# EAGLE design Robot Logic v4.5 (EAGLE 4.16)
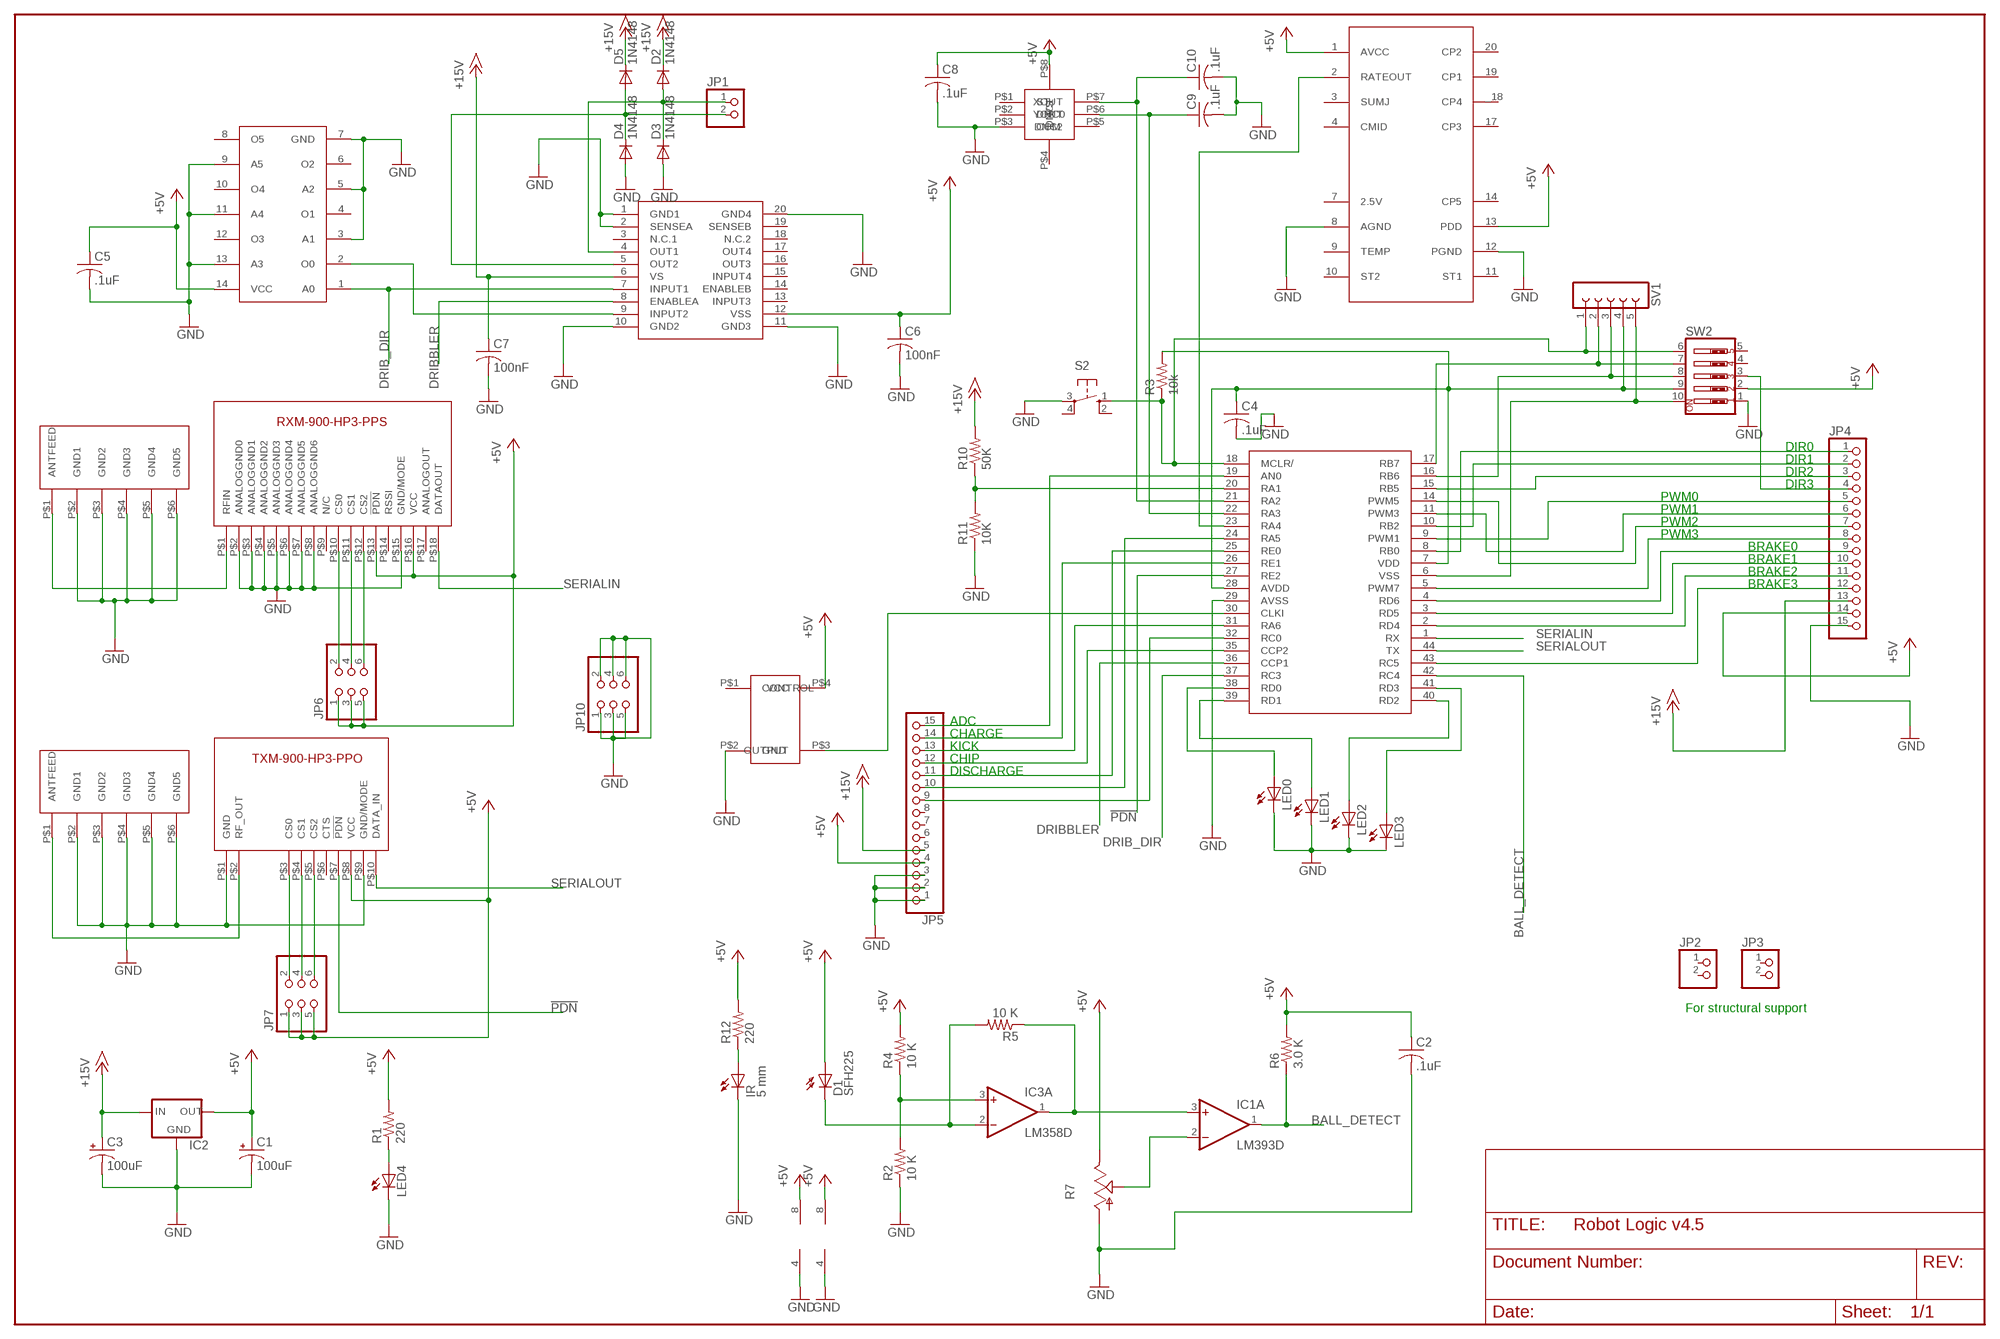
[diagram p0: schematic, sheet 1]

## Parts
C1  100uF  CPOL-USE3.5-8  [E3,5-8]
C2  .1uF  C-USC1206  [C1206]
C3  100uF  CPOL-USE3.5-8  [E3,5-8]
C4  .1uF  C-USC1206  [C1206]
C5  .1uF  C-USC1206  [C1206]
C6  100nF  C-USC1206  [C1206]
C7  100nF  C-USC1206  [C1206]
C8  .1uF  C-USC1206  [C1206]
C9  .1uF  C-USC1206  [C1206]
C10  .1uF  C-USC1206  [C1206]
D1  SFH225  [SFH225]
D2  1N4148  [DO35-10]
D3  1N4148  [DO35-10]
D4  1N4148  [DO35-10]
D5  1N4148  [DO35-10]
IC1  LM393D  [SO08]
IC2  78LXX  [D2PACK]
IC3  LM358D  [SO08]
IR  5 mm  LED3MM  [LED3MM]
JP1  PINHD-1X2  [1X02]
JP2  PINHD-1X2  [1X02]
JP3  PINHD-1X2  [1X02]
JP4  PINHD-1X15  [1X15]
JP5  PINHD-1X15  [1X15]
JP6  PINHD-2X3  [2X03]
JP7  PINHD-2X3  [2X03]
JP10  PINHD-2X3  [2X03]
LED0  LEDCHIPLED_1206  [CHIPLED_1206]
LED1  LEDCHIPLED_1206  [CHIPLED_1206]
LED2  LEDCHIPLED_1206  [CHIPLED_1206]
LED3  LEDCHIPLED_1206  [CHIPLED_1206]
LED4  LEDCHIPLED_1206  [CHIPLED_1206]
R1  220  R-US_R1206  [R1206]
R2  10 K  R-US_R1206  [R1206]
R3  10k  R-US_R1206  [R1206]
R4  10 K  R-US_R1206  [R1206]
R5  10 K  R-US_R1206  [R1206]
R6  3.0 K  R-US_R1206  [R1206]
R7  TRIM_US-  [MYPOT]
R10  50K  R-US_R1206  [R1206]
R11  10K  R-US_R1206  [R1206]
R12  220  R-US_R1206  [R1206]
S2  10-XX  [B3F-10XX]
SV1  FE05-1  [FE05-1]
SW2  SW_DIP-5  [EDG-05]
U$1  PIC18F4431  [TQFP44]
U$2  ADXL203  [LCC8]
U$3  L298  [POWERSO-20]
U$4  RX  [RX_FLAT]
U$5  SMDOSCILLATOR  [SMDOSCILLATOR]
U$6  ANT-916-SP  [ANT-916-SP]
U$7  INVERTER  [SOP14]
U$8  ADXRS150EB  [DIL20]
U$9  ANT-916-SP  [ANT-916-SP]
U$10  TXM-900-HP3-PP  [TXM-900-HP3-PP]

## Nets
!PDN: U$1.27(RE2) U$10.P$7(!PDN)
+5V [supply]: C1.+ C5.1 C6.1 C8.1 IC2.3(OUT) JP4.14 JP5.4 JP6.1 JP6.3 JP6.5 R1.2 SW2.2 U$2.P$8(VS) U$3.12(VSS) U$4.P$13(!PDN) U$4.P$16(VCC) U$5.P$4(VCC) U$7.14(VCC) U$8.1(AVCC) U$8.13(PDD)
+15V [supply]: C3.+ C7.1 D2.C D5.C IC2.1(IN) JP4.13 JP5.5 R10.2 U$3.6(VS)
BALL_DETECT: IC1.1(A:OUT) R6.1 U$1.42(RC4)
BRSHLS: JP4.1 U$1.8(RB0)
DRIB_DIR: U$1.37(RC3) U$3.7(INPUT1) U$7.1(A0)
DRIBBLER: U$1.36(CCP1) U$3.8(ENABLEA)
GND [supply]: C1.- C2.2 C3.- C4.2 C5.2 C6.2 C7.2 C8.2 C9.2 C10.2 D3.A D4.A IC1.4(P:V-) IC2.2(GND) IC3.4(P:V-) IR.K(C) JP4.15 JP5.1 JP5.2 JP5.3 JP10.1 JP10.2 JP10.3 JP10.4 JP10.5 JP10.6 LED0.C LED1.C LED2.C LED3.C LED4.C R2.1 R7.P$1(A) R11.1 S2.3(P) SW2.1 U$1.29(AVSS) U$2.P$3(COM) U$3.1(GND1) U$3.2(SENSEA) U$3.10(GND2) U$3.11(GND3) U$3.20(GND4) U$4.P$2(ANALOGGND0) U$4.P$3(ANALOGGND1) U$4.P$4(ANALOGGND2) U$4.P$5(ANALOGGND3) U$4.P$6(ANALOGGND4) U$4.P$7(ANALOGGND5) U$4.P$8(ANALOGGND6) U$4.P$15(GND/MODE) U$5.P$2(GND) U$6.P$2(GND1) U$6.P$3(GND2) U$6.P$4(GND3) U$6.P$5(GND4) U$6.P$6(GND5) U$7.3(A1) U$7.5(A2) U$7.7(GND) U$7.9(A5) U$7.11(A4) U$7.13(A3) U$8.8(AGND) U$8.12(PGND) U$9.P$2(GND1) U$9.P$3(GND2) U$9.P$4(GND3) U$9.P$5(GND4) U$9.P$6(GND5) U$10.P$1(GND) U$10.P$9(GND/MODE)
N$1: C10.1 U$1.21(RA2) U$2.P$7(XOUT)
N$2: LED2.A U$1.40(RD2)
N$3: JP5.14 U$1.26(RE1)
N$4: C9.1 U$1.22(RA3) U$2.P$6(YOUT)
N$5: U$1.23(RA4) U$8.2(RATEOUT)
N$6: R3.1 S2.1(S) SV1.1 SW2.6 U$1.18(MCLR/)
N$7: JP5.10 U$1.24(RA5)
N$8: SV1.3 SW2.8 U$1.16(RB6)
N$9: JP5.11 U$1.25(RE0)
N$11: JP5.12 U$1.35(CCP2)
N$12: JP4.3 U$1.15(RB5)
N$13: LED1.A U$1.39(RD1)
N$14: JP4.8 U$1.5(PWM7)
N$15: JP4.2 U$1.10(RB2)
N$16: JP4.5 U$1.9(PWM1)
N$17: R10.1 R11.2 U$1.20(RA1)
N$18: IR.A R12.1
N$19: LED3.A U$1.41(RD3)
N$21: JP4.4 SW2.3
N$22: LED4.A R1.1
N$23: JP6.4 U$4.P$11(CS1)
N$24: JP5.9 U$1.32(RC0)
N$25: JP5.13 U$1.31(RA6)
N$26: U$1.30(CLKI) U$5.P$3(OUTPUT)
N$29: JP5.15 U$1.19(AN0)
N$30: JP6.6 U$4.P$12(CS2)
N$31: JP6.2 U$4.P$10(CS0)
N$32: JP4.9 U$1.4(RD6)
N$33: SV1.5 SW2.10 U$1.6(VSS)
N$34: SV1.2 SW2.7 U$1.17(RB7)
N$35: JP4.7 U$1.14(PWM5)
N$36: JP4.6 U$1.11(PWM3)
N$37: JP4.10 U$1.3(RD5)
N$38: JP4.11 U$1.2(RD4)
N$39: C4.1 R3.2 SV1.4 SW2.9 U$1.7(VDD) U$1.28(AVDD)
N$40: JP4.12 U$1.43(RC5)
N$41: JP7.2 U$10.P$3(CS0)
N$42: D1.K(C) IC3.2(A:-IN) R5.2
N$43: IC3.3(A:+IN) R2.2 R4.1
N$44: IC1.3(A:+IN) IC3.1(A:OUT) R5.1
N$45: U$4.P$1(RFIN) U$6.P$1(ANTFEED)
N$46: JP7.4 U$10.P$4(CS1)
N$47: IC1.2(A:-IN) R7.P$3(S)
N$48: LED0.A U$1.38(RD0)
N$49: JP7.6 U$10.P$5(CS2)
N$50: U$3.9(INPUT2) U$7.2(O0)
N$51 [current]: D2.A D3.C JP1.1 U$3.4(OUT1)
N$52 [current]: D4.C D5.A JP1.2 U$3.5(OUT2)
N$57: U$9.P$1(ANTFEED) U$10.P$2(RF_OUT)
SERIALIN: U$1.1(RX) U$4.P$18(DATAOUT)
SERIALOUT: U$1.44(TX) U$10.P$10(DATA_IN)
VCC: C2.1 D1.A IC1.8(P:V+) IC3.8(P:V+) JP7.1 JP7.3 JP7.5 R4.2 R6.2 R7.P$2(E) R12.2 U$10.P$8(VCC) ; supply symbol labelled +5V
Unconnected: IC1.5(B:+IN) IC1.6(B:-IN) IC1.7(B:OUT) IC3.5(B:+IN) IC3.6(B:-IN) IC3.7(B:OUT) JP2.1 JP2.2 JP3.1 JP3.2 JP5.6 JP5.7 JP5.8 S2.2(S1) S2.4(P1) SW2.4 SW2.5 U$2.P$1(ST) U$2.P$2(DNC0) U$2.P$4(DNC1) U$2.P$5(DNC2) U$3.3(N.C.1) U$3.13(INPUT3) U$3.14(ENABLEB) U$3.15(INPUT4) U$3.16(OUT3) U$3.17(OUT4) U$3.18(N.C.2) U$3.19(SENSEB) U$4.P$9(N/C) U$4.P$14(RSSI) U$4.P$17(ANALOGOUT) U$5.P$1(CONTROL) U$7.4(O1) U$7.6(O2) U$7.8(O5) U$7.10(O4) U$7.12(O3) U$8.3(SUMJ) U$8.4(CMID) U$8.7(2.5V) U$8.9(TEMP) U$8.10(ST2) U$8.11(ST1) U$8.14(CP5) U$8.17(CP3) U$8.19(CP1) U$8.20(CP2) U$8._18(CP4) U$10.P$6(CTS)

## Notes on the sheet
- DIR0
- DIR1
- DIR2
- DIR3
- PWM0
- PWM1
- PWM2
- PWM3
- BRAKE0
- BRAKE1
- BRAKE2
- BRAKE3
- ADC
- CHARGE
- KICK
- CHIP
- DISCHARGE
- For structural support

## Library data of the parts
C1 C3 = rcl:CPOL-US: POLARIZED CAPACITOR, American symbol
C2 C4-C10 = rcl:C-US: CAPACITOR, American symbol
D1 = opto-trans-siemens:SFH225: PHOTO DIODE
D2-D5 = diode:1N4148: DIODE high speed (Philips)
IC1 = linear:LM393: COMPARATOR
IC2 = v-reg:78LXX: VOLTAGE REGULATOR
IC3 = linear:LM358: OP AMP
IR LED0 LED1-LED4 = led:LED: LED OSRAM: - CHIPLED LG R971, LG N971, LY N971, LG Q971, LY Q971, LO R971, LY R971 LH N974, LH R974 LS Q976, LO Q976, LY Q976 LO Q996 - Hyper CHIPLED LW Q18S LB Q993, LB Q99A, LB R99A - SideLED LS A670, LO A670, LY A670, LG A670, LP A670 LB A673, LV A673, LT A673, LW A673 LH A674 LY A675 LS A676, LA A676, LO A676, LY A676, LW A676 LS A679, LY A679, LG A679 - Hyper Micro SIDELED® LS Y876, LA Y876, LO Y876, LY Y876 LT Y87S - SmartLED LW L88C, LW L88S LB L89C, LB L89S, LG L890 LS L89K, LO L89K, LY L89K LS L896, LA L896, LO L896, LY L896 - TOPLED LS T670, LO T670, LY T670, LG T670, LP T670 LSG T670, LSP T670, LSY T670, LOP T670, LYG T670 LG T671, LOG T671, LSG T671 LB T673, LV T673, LT T673, LW T673 LH T674 LS T676, LA T676, LO T676, LY T676, LB T676, LH T676, LSB T676, LW T676 LB T67C, LV T67C, LT T67C, LS T67K, LO T67K, LY T67K, LW E67C LS E67B, LA E67B, LO E67B, LY E67B, LB E67C, LV E67C, LT E67C LW T67C LS T679, LY T679, LG T679 LS T770, LO T770, LY T770, LG T770, LP T770 LB T773, LV T773, LT T773, LW T773 LH T774 LS E675, LA E675, LY E675, LS T675 LS T776, LA T776, LO T776, LY T776, LB T776 LHGB T686 LT T68C, LB T68C - Hyper Mini TOPLED® LB M676 - Mini TOPLED Santana® LG M470 LS M47K, LO M47K, LY M47K Source: http://www.osram.convergy.de/
JP1-JP3 = pinhead:PINHD-1X2: PIN HEADER
JP4 JP5 = pinhead:PINHD-1X15: PIN HEADER
JP6 JP7 JP10 = pinhead:PINHD-2X3: PIN HEADER
R1-R6 R10-R12 = rcl:R-US_: RESISTOR, American symbol
R7 = pot:TRIM_US-: POTENTIOMETER
S2 = switch-omron:10-XX: OMRON SWITCH
SV1 = con-lsta:FE05-1: FEMALE HEADER
SW2 = special:SW_DIP-5: DIP SWITCH
U$1 = microchip:PIC18F4431
U$2 = ADXL203:ADXL203
U$3 = L298:L298
U$4 = linxtechnologies:RX
U$5 = smd-oscillator:SMDOSCILLATOR
U$6 U$9 = smd-oscillator:ANT-916-SP
U$7 = smd-ipc:INVERTER
U$8 = gyro:ADXRS150EB
U$10 = linxtechnologies:TXM-900-HP3-PP

## Net classes
1 supply: width 0.508 mm
2 current: width 0.254 mm

## Board
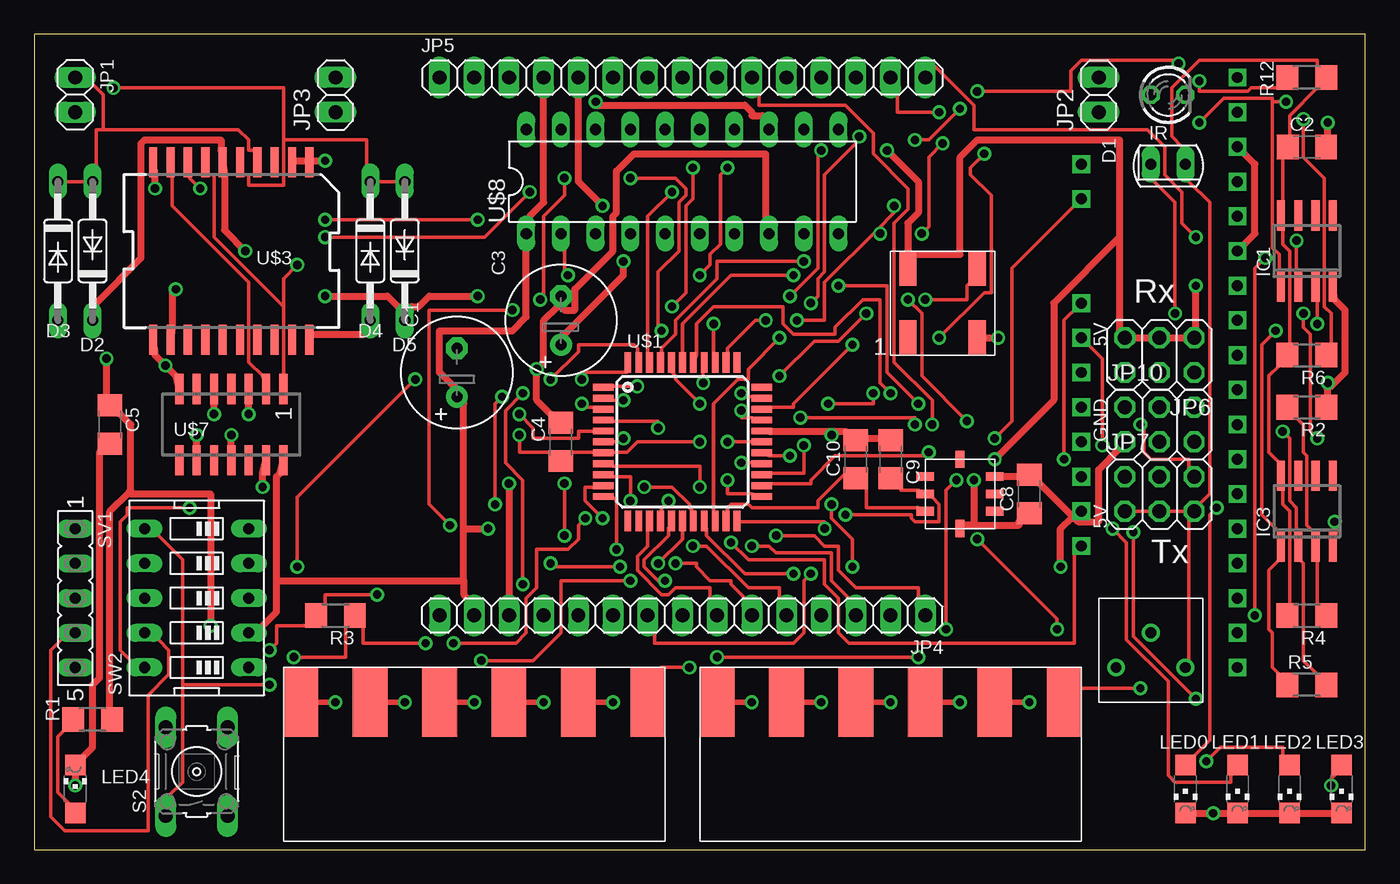
[diagram p1: board, top side]
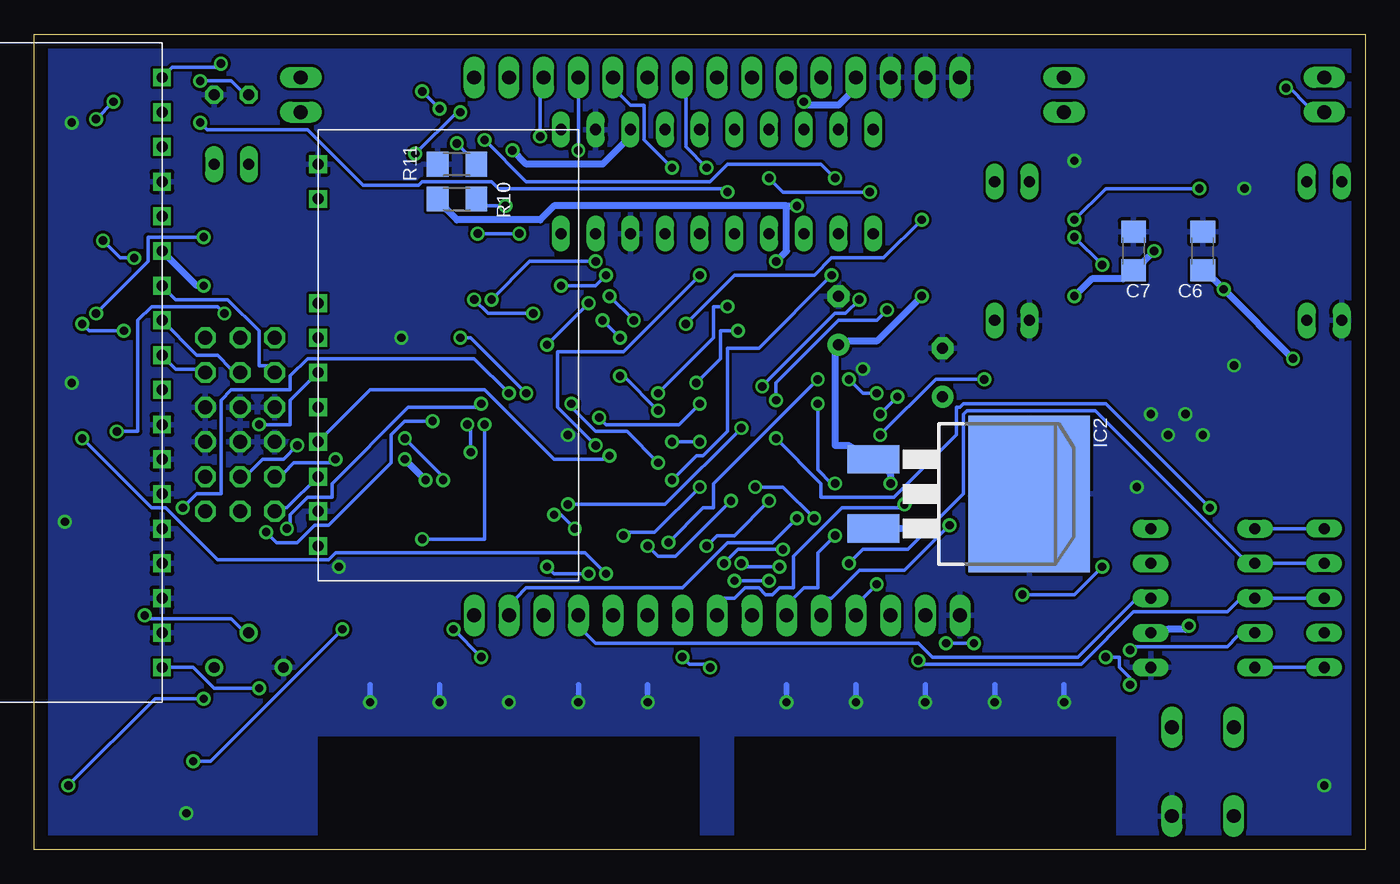
[diagram p2: board, bottom side, seen from below]

Size 97.46 x 59.68 mm. Coordinates in mm from the lower left corner, seen from the top.
Outline: 0,0 97.46,0 97.46,59.68 0,59.68 0,0
Copper layers (1*16): Top 0.035mm / dielectric 1.5mm / Bottom 0.035mm
Design rules "default": minimum track width 10mil, minimum drill 24mil, track to track 8mil, track to pad 8mil, pad to pad 8mil, via to via 8mil, smd to smd 8mil, copper to edge 40mil, drill to drill 8mil, minimum pad ring 10mil, minimum via ring 8mil, stop-mask expansion 4mil, vias tented up to drill 0mil, thermal gap 10mil
tRestrict: area 18.2,-3.2 to 46.2,8.2; area 48.7,-3.2 to 76.7,8.2
bRestrict: area 18.2,-5.7 to 46.2,8.2; area 48.7,-5.7 to 76.7,8.2

### Footprints (pad centres in the part's own frame; a part is rotated, then mirrored left to right if it is on the bottom)
E3,5-8 = drill 0.813 pad 1.6 round: + -1.778,0 | drill 0.813 pad 1.6 octagon: - 1.778,0
C1206 = smd 1.6 x 1.8: 1 -1.4,0; 2 1.4,0
SFH225 = drill 0.813 long: A 0,1.27; K 0,-1.27
DO35-10 = drill 0.813 long: A 5.08,0; C -5.08,0
SO08 = smd 0.6 x 2.2: 1 -1.905,-2.6; 2 -0.635,-2.6; 3 0.635,-2.6; 4 1.905,-2.6; 5 1.905,2.6; 6 0.635,2.6; 7 -0.635,2.6; 8 -1.905,2.6
D2PACK = smd 2.083 x 3.81: 1 -2.54,-8.89; 3 2.54,-8.89 | smd 11.43 x 8.89: 2 0,2.54
LED3MM = drill 0.813 octagon: A -1.27,0; K 1.27,0
1X02 = drill 1.016 long: 1 -1.27,0; 2 1.27,0
1X15 = drill 1.016 long: 1 -17.78,0; 2 -15.24,0; 3 -12.7,0; 4 -10.16,0; 5 -7.62,0; 6 -5.08,0; 7 -2.54,0; 8 0,0; 9 2.54,0; 10 5.08,0; 11 7.62,0; 12 10.16,0; 13 12.7,0; 14 15.24,0; 15 17.78,0
2X03 = drill 1.016 octagon: 1 -2.54,-1.27; 2 -2.54,1.27; 3 0,-1.27; 4 0,1.27; 5 2.54,-1.27; 6 2.54,1.27
CHIPLED_1206 = smd 1.5 x 1.5: A 0,-1.75; C 0,1.75
R1206 = smd 1.6 x 1.803: 1 -1.422,0; 2 1.422,0
MYPOT = drill 0.8 round: P$1 6.35,5.08; P$2 1.27,5.08; P$3 3.81,2.54
B3F-10XX = drill 1.016 long: 1 -3.251,2.261; 2 3.251,2.261; 3 -3.251,-2.261; 4 3.251,-2.261
FE05-1 = drill 0.813 long: 1 -5.08,0; 2 -2.54,0; 3 0,0; 4 2.54,0; 5 5.08,0
EDG-05 = drill 0.813 long: 1 -5.08,-3.81; 2 -2.54,-3.81; 3 0,-3.81; 4 2.54,-3.81; 5 5.08,-3.81; 6 5.08,3.81; 7 2.54,3.81; 8 0,3.81; 9 -2.54,3.81; 10 -5.08,3.81
TQFP44 = smd 1.5 x 0.5: 1 -5.8,4; 2 -5.8,3.2; 3 -5.8,2.4; 4 -5.8,1.6; 5 -5.8,0.8; 6 -5.8,0; 7 -5.8,-0.8; 8 -5.8,-1.6; 9 -5.8,-2.4; 10 -5.8,-3.2; 11 -5.8,-4; 23 5.8,-4; 24 5.8,-3.2; 25 5.8,-2.4; 26 5.8,-1.6; 27 5.8,-0.8; 28 5.8,0; 29 5.8,0.8; 30 5.8,1.6; 31 5.8,2.4; 32 5.8,3.2; 33 5.8,4 | smd 0.5 x 1.5: 12 -4,-5.8; 13 -3.2,-5.8; 14 -2.4,-5.8; 15 -1.6,-5.8; 16 -0.8,-5.8; 17 0,-5.8; 18 0.8,-5.8; 19 1.6,-5.8; 20 2.4,-5.8; 21 3.2,-5.8; 22 4,-5.8; 34 4,5.8; 35 3.2,5.8; 36 2.4,5.8; 37 1.6,5.8; 38 0.8,5.8; 39 0,5.8; 40 -0.8,5.8; 41 -1.6,5.8; 42 -2.4,5.8; 43 -3.2,5.8; 44 -4,5.8
LCC8 = smd 1.27 x 0.635: P$1 0,3.81; P$2 0,2.54; P$3 0,1.27; P$5 5.08,1.27; P$6 5.08,2.54; P$7 5.08,3.81 | smd 0.635 x 1.27: P$4 2.54,0; P$8 2.54,5.08
POWERSO-20 = smd 0.6 x 2.2: 1 -5.715,-6.5; 2 -4.445,-6.5; 3 -3.175,-6.5; 4 -1.905,-6.5; 5 -0.635,-6.5; 6 0.635,-6.5; 7 1.905,-6.5; 8 3.175,-6.5; 9 4.445,-6.5; 10 5.715,-6.5; 11 5.715,6.5; 12 4.445,6.5; 13 3.175,6.5; 14 1.905,6.5; 15 0.635,6.5; 16 -0.635,6.5; 17 -1.905,6.5; 18 -3.175,6.5; 19 -4.445,6.5; 20 -5.715,6.5
RX_FLAT = drill 0.8 square: P$1 0,0; P$2 2.54,0; P$3 5.08,0; P$4 7.62,0; P$5 10.16,0; P$6 12.7,0; P$7 15.24,0; P$8 17.78,0; P$9 20.32,0; P$10 22.86,0; P$11 25.4,0; P$12 27.94,0; P$13 30.48,0; P$14 33.02,0; P$15 35.56,0; P$16 38.1,0; P$17 40.64,0; P$18 43.18,0
SMDOSCILLATOR = smd 1.27 x 2.54: P$1 0,0; P$2 5.08,0; P$3 5.08,5.08; P$4 0,5.08
ANT-916-SP = smd 2.54 x 5.08: P$1 -7.62,0; P$2 -2.54,0; P$3 2.54,0; P$4 7.62,0; P$5 12.7,0; P$6 17.78,0
SOP14 = smd 0.6 x 2.2: 1 -3.81,-2.6; 2 -2.54,-2.6; 3 -1.27,-2.6; 4 0,-2.6; 5 1.27,-2.6; 6 2.54,-2.6; 7 3.81,-2.6; 8 3.81,2.6; 9 2.54,2.6; 10 1.27,2.6; 11 0,2.6; 12 -1.27,2.6; 13 -2.54,2.6; 14 -3.81,2.6
DIL20 = drill 0.813 long: 1 -8.89,-3.81; 2 -6.35,-3.81; 3 -3.81,-3.81; 4 -1.27,-3.81; 5 1.27,-3.81; 6 3.81,-3.81; 7 6.35,-3.81; 8 8.89,-3.81; 9 11.43,-3.81; 10 13.97,-3.81; 11 13.97,3.81; 12 11.43,3.81; 13 8.89,3.81; 14 6.35,3.81; 15 3.81,3.81; 16 1.27,3.81; 17 -1.27,3.81; 18 -8.89,3.81; 19 -6.35,3.81; 20 -8.89,3.81; _18 -3.81,3.81
TXM-900-HP3-PP = drill 0.8 square: P$1 2.54,0; P$2 5.08,0; P$3 12.7,0; P$4 15.24,0; P$5 17.78,0; P$6 20.32,0; P$7 22.86,0; P$8 25.4,0; P$9 27.94,0; P$10 30.48,0

### Placement (x,y rotation side)
C1  30.95,34.92 90 top
C2  93.18,51.43 0 top
C3  38.57,38.73 90 top
C4  38.57,29.84 90 top
C5  5.55,31.11 270 top
C6  11.9,43.81 90 bottom
C7  16.98,43.81 90 bottom
C8  72.86,26.03 90 top
C9  62.7,28.57 90 top
C10  60.16,28.57 90 top
D1  83.02,50.16 270 top
D2  4.28,43.81 90 top
D3  1.74,43.81 270 top
D4  24.6,43.81 270 top
D5  27.14,43.81 90 top
IC1  93.18,43.81 0 top
IC2  27.14,26.03 270 bottom
IC3  93.18,24.76 0 top
IR  83.02,55.24 0 top
JP1  3.01,55.24 270 top
JP2  77.94,55.24 90 top
JP3  22.06,55.24 90 top
JP4  47.46,17.14 180 top
JP5  47.46,56.51 0 top
JP6  82.39,36.19 180 top
JP7  82.39,26.03 0 top
JP10  82.39,31.11 0 top
LED0  84.29,4.44 180 top
LED1  88.1,4.44 180 top
LED2  91.91,4.44 180 top
LED3  95.72,4.44 180 top
LED4  3.01,4.44 0 top
R1  4.28,9.52 0 top
R2  93.18,32.38 180 top
R3  22.06,17.14 180 top
R4  93.18,17.14 180 top
R5  93.18,12.06 0 top
R6  93.18,36.19 180 top
R7  85.56,18.41 180 top
R10  66.51,47.62 180 bottom
R11  66.51,50.16 0 bottom
R12  93.18,56.51 0 top
S2  11.9,5.71 90 top
SV1  3.01,18.41 270 top
SW2  11.9,18.41 90 top
U$1  47.46,29.84 0 top
U$2  70.32,28.57 180 top
U$3  14.44,43.81 180 top
U$4  88.1,13.33 90 bottom
U$5  63.97,37.46 0 top
U$6  67.78,10.79 180 top
U$7  14.44,31.11 180 top
U$8  44.92,48.89 0 top
U$9  37.3,10.79 180 top
U$10  76.67,52.7 270 bottom

### Tracks (layer width: path | path; a pad name or v marks a point on that pad's centre or on a via)
!PDN  (via drill 0.61)
  Top 0.254: v55.33,28.82 53.81,28.82 U$1.27
  Bottom 0.254: v55.33,28.82 55.59,28.57 59.4,28.57 64.48,33.65 72.86,33.65 U$10.P$7
+5V  (via drill 0.61)
  Top 0.508: U$4.P$13 89.37,45.08 89.37,50.16 U$4.P$16 | 68.8,23.74 72.1,23.74 72.1,24 C8.1 | 68.8,23.74 68.03,23.74 U$2.P$8 | 79.46,44.83 79.46,37.97 JP6.5 JP6.3 JP6.1 85.05,37.97 v85.05,41.27 | 79.46,44.83 79.46,51.94 69.05,51.94 67.78,50.67 67.78,43.56 64.48,43.56 U$5.P$4 63.97,45.84 64.73,46.6 64.73,48.89 v62.45,51.18 | v68.8,27.05 68.8,23.74 | v70.32,28.57 74.64,32.89 74.64,40 79.46,44.83 | v10.38,41.02 10.12,40.76 10.12,38.22 U$3.12 | 6.95,26.16 5.55,24.76 5.55,10.28 R1.2 | 6.95,26.16 7.07,26.28 7.07,31.11 6.31,31.87 C5.1 5.3,33.14 v5.3,35.94 | JP5.4 37.3,47.37 36.28,46.35 U$8.1 36.03,38.98 35.01,37.97 29.68,37.97 29.68,34.92 30.7,33.9 C1.+ 31.46,32.63 31.46,23.49 | v41.11,54.73 41.11,54.48 52.03,54.48 52.54,53.97 52.54,53.72 53.3,53.72 U$8.13 | 17.74,19.68 17.74,17.39 16.73,16.38 SW2.2 | 17.74,19.68 17.74,27.3 18,27.55 U$7.14 | 31.46,19.68 31.46,23.49 | 31.46,19.68 31.46,18.66 31.71,18.41 JP4.14 | 31.46,23.49 v33.24,23.49 | 17.74,19.68 31.46,19.68 | v12.92,16.38 12.92,26.03 7.07,26.03 6.95,26.16
  Bottom 0.508: v70.32,28.57 v68.8,27.05 | v85.05,41.27 85.56,41.27 U$4.P$13 | C6.1 11.14,41.78 v10.38,41.02 v5.3,35.94 | v41.11,54.73 40.86,54.48 38.57,54.48 37.81,55.24 JP5.4 | v33.24,23.49 IC2.3 | v12.92,16.38 13.17,16.12 14.44,16.12 SW2.2 | v62.45,51.18 61.43,50.16 55.84,50.16 54.32,51.68 U$8.13
+15V  (via drill 0.61)
  Top 0.508: v15.46,43.81 13.93,45.33 13.93,49.4 U$3.6 13.68,51.18 13.68,51.94 8.09,51.94 7.84,51.68 7.84,43.3 4.53,40 D2.C | v21.3,40.51 25.87,40.51 26.63,39.75 D5.C 27.65,39.75 28.16,39.75 28.92,40.51 v32.47,40.51 | v34.76,26.79 JP4.13 | v41.62,47.11 39.84,48.89 JP5.5 | v43.14,43.05 43.14,42.03 38.82,37.71 C3.+
  Bottom 0.508: v15.46,43.81 16.22,43.05 C7.1 17.74,41.78 20.03,41.78 v21.3,40.51 | v34.76,26.79 34.76,27.55 IC2.1 37.81,29.59 38.82,29.59 38.82,36.19 C3.+ 37.81,37.21 35.78,37.21 v32.47,40.51 | 42.38,47.11 v41.62,47.11 | 42.38,47.11 59.4,47.11 60.41,46.1 66.51,46.1 67.27,46.86 R10.2 | v43.14,43.05 42.38,43.81 42.38,47.11
BALL_DETECT  (via drill 0.61)
  Top 0.254: v46.7,48.13 44.92,46.35 44.92,36.19 U$1.42 | v85.31,53.21 87.08,54.99 90.64,54.99 90.64,54.73 | 90.64,54.73 90.64,44.06 91.15,43.56 91.15,42.29 IC1.1 | v92.93,53.46 92.93,50.67 94.45,49.14 94.45,39.75 94.96,39.24 94.96,36.95 R6.1 | 90.64,54.73 v91.66,54.73
  Bottom 0.254: v46.7,48.13 46.95,48.38 63.46,48.38 63.97,48.89 69.05,48.89 69.3,48.64 73.37,48.64 77.43,52.7 84.8,52.7 v85.31,53.21 | v91.66,54.73 v92.93,53.46
BRSHLS  (via drill 0.61)
  Top 0.254: v48.73,26.54 48.73,28.06 42.38,28.06 U$1.8 | v54.32,22.98 57.11,22.98 57.87,22.22 58.89,22.22 58.89,20.44 60.16,19.17 64.73,19.17 64.73,18.41 JP4.1
  Bottom 0.254: v48.73,26.54 52.03,23.24 54.06,23.24 v54.32,22.98
DRIB_DIR  (via drill 0.61)
  Top 0.254: v48.98,34.16 48.98,34.92 U$1.37 | v45.94,37.97 45.68,38.22 45.68,42.29 47.21,43.81 47.21,47.37 47.71,47.87 47.71,48.38 46.95,49.14 v43.65,49.14 | v36.28,48.13 32.98,44.83 v21.3,44.83 | v19.27,42.79 18.25,41.78 18.25,39.75 | U$7.1 18.25,39.75 | 18.25,39.75 13.17,44.83 13.17,49.4 12.66,49.4 U$3.7
  Bottom 0.254: v48.98,34.16 47.21,35.94 47.21,37.97 v45.94,37.97 | v43.65,49.14 42.63,48.13 v36.28,48.13 | v19.27,42.79 v21.3,44.83
DRIBBLER  (via drill 0.61)
  Top 0.254: v49.75,38.48 49.75,36.19 U$1.36 | v21.3,46.1 v32.47,46.1 | v12.15,48.38 11.39,49.14 11.39,49.4 U$3.8
  Bottom 0.254: v49.75,38.48 46.19,42.03 40.35,42.03 39.08,43.3 35.27,43.3 v32.47,46.1 | v21.3,46.1 19.01,48.38 v12.15,48.38
GND  (via drill 0.6, 0.61)
  Top 0.406: U$9.P$6 v22.06,10.79 | U$9.P$5 v27.14,10.79 | U$9.P$4 v32.22,10.79 | U$9.P$3 v37.3,10.79 | U$9.P$2 v42.38,10.79 | U$6.P$6 v52.54,10.79 | U$6.P$5 v57.62,10.79 | U$6.P$4 v62.7,10.79 | U$6.P$3 v67.78,10.79 | U$6.P$2 v72.86,10.79
  Top 0.508: LED0.C 84.8,2.66 v86.32,2.66 87.59,2.66 LED1.C 88.61,2.66 91.4,2.66 LED2.C 92.42,2.66 95.21,2.66 LED3.C | U$2.P$3 72.1,27.3 C8.2 73.62,26.79 76.03,24.38 | 76.03,24.38 76.16,24.25 | 58.38,30.6 59.4,30.6 C10.2 60.92,30.09 61.94,30.09 C9.2 | 58.38,30.6 53.81,30.6 U$1.29 | U$7.7 10.38,34.67 v9.61,35.43 8.85,36.19 8.85,36.44 U$3.11 | U$3.2 19.01,50.41 20.03,50.41 U$3.1 20.28,50.41 v21.3,50.41 | v3.01,4.69 LED4.C 3.52,6.73 4.28,7.49 4.28,12.06 4.79,12.57 4.79,29.08 C5.2 | C4.2 37.81,31.87 36.79,32.89 v36.79,35.17 37.3,35.68 37.3,38.73 38.32,39.75 C3.- 38.57,39.75 38.82,39.49 39.59,39.49 39.59,41.02 42.38,43.81 42.38,46.35 42.63,46.6 42.63,49.65 43.9,50.92 53.56,50.92 53.56,46.35 U$8.8 | v94.7,53.21 94.7,52.19 C2.2 | R2.1 94.7,33.14 v94.7,34.16 94.96,33.9 95.97,34.92 95.97,39.49 95.21,40.25 IC1.4 | U$7.9 v11.9,30.35 | U$7.11 v14.44,30.35 | v16.73,26.54 16.73,27.55 U$7.13 | v13.17,31.87 U$7.5 | v15.71,31.87 U$7.3 | U$3.20 20.28,37.71 24.09,37.71 D4.A | v8.85,48.38 8.85,49.4 U$3.10 | v95.21,24 95.21,23.24 IC3.4 | U$5.P$2 v70.57,37.46 | 58.38,30.6 v58.38,30.35 | v75.15,20.7 75.15,23.49 76.03,24.38 | 76.16,24.25 76.42,24 77.94,24 77.94,27.81 79.46,29.33 JP10.1 | 76.16,24.25 U$10.P$9
  Bottom 0.406: v22.06,10.79 22.06,12.06 | v27.14,10.79 27.14,12.06 | v32.22,10.79 32.22,12.06 | v37.3,10.79 37.3,12.06 | v42.38,10.79 42.38,12.06 | v52.54,10.79 52.54,12.06 | v57.62,10.79 57.62,12.06 | v67.78,10.79 67.78,12.06 | v72.86,10.79 72.86,12.06
  pour Bottom: -0.8,-0.64 -0.8,60.32 98.26,60.32 98.26,-0.64
N$1
  Top 0.254: U$2.P$7 64.73,25.01 60.92,25.01 60.92,26.54 C10.1 59.4,27.55 57.37,25.52 57.37,25.01 52.54,25.01 52.29,25.27 51.02,25.27 50.76,25.01 50.76,24.76 U$1.21
N$2  (via drill 0.61)
  Top 0.254: v48.73,32.63 46.95,34.41 46.95,34.67 46.7,34.92 U$1.40 | v56.1,31.62 64.48,31.62 v64.48,31.11 | v69.05,22.73 74.89,16.89 v74.89,16.12 | v85.81,6.47 86.83,7.49 91.4,7.49 91.4,6.73 LED2.A
  Bottom 0.254: v48.73,32.63 50.25,31.11 55.59,31.11 v56.1,31.62 | v64.48,31.11 64.48,22.73 v69.05,22.73 | v74.89,16.12 84.54,6.47 v85.81,6.47
N$3  (via drill 0.61)
  Top 0.254: v51.78,28.32 52.54,28.32 U$1.26 | v58.13,32.63 61.43,32.63 v61.43,33.4 | v66.26,37.46 69.56,40.76 70.07,40.76 70.07,47.87 68.54,49.4 68.54,49.91 v69.56,50.92 | v66.26,53.97 63.21,53.97 63.21,55.24 JP5.14
  Bottom 0.254: v51.78,28.32 54.06,30.6 56.35,30.6 58.13,32.38 v58.13,32.63 | v61.43,33.4 65.49,37.46 v66.26,37.46 | v69.56,50.92 66.51,53.97 v66.26,53.97
N$4  (via drill 0.61)
  Top 0.254: C9.1 63.46,26.54 63.46,26.28 64.73,26.28 U$2.P$6 65.75,25.78 66.26,25.27 66.26,24 64.48,24 64.22,24.25 64.22,24.51 v59.4,24.51 | v57.87,23.49 57.87,24 51.52,24 U$1.22
  Bottom 0.254: v57.87,23.49 58.89,24.51 v59.4,24.51
N$5  (via drill 0.61)
  Top 0.254: v50.76,27.05 50.76,26.03 52.54,26.03 U$1.23 | v39.08,42.03 38.82,42.29 38.82,43.81 U$8.2
  Bottom 0.254: v50.76,27.05 48.98,28.82 48.48,28.82 46.7,30.6 46.7,36.7 44.41,36.7 v39.08,42.03
N$6  (via drill 0.61)
  Top 0.254: 10.88,12.06 10.88,21.2 9.11,22.98 SW2.6 | 10.88,12.06 10.88,4.95 9.87,3.93 S2.1 | v44.67,26.54 46.7,26.54 47.97,25.27 47.97,25.01 48.22,24.76 U$1.18 | v40.35,24.25 39.84,23.74 39.84,22.73 39.08,21.97 36.79,21.97 36.79,19.17 36.03,18.41 36.03,15.87 35.27,15.11 v30.7,15.11 | v28.66,15.11 24.09,15.11 24.09,16.38 R3.1 22.82,16.38 22.82,14.09 v19.01,14.09 | 10.88,12.06 v17.23,12.06
  Bottom 0.254: SW2.6 SV1.1 | v44.67,26.54 42.63,26.54 v40.35,24.25 | v28.66,15.11 v30.7,15.11 | v17.23,12.06 17.23,12.57 18,13.33 18,14.09 v19.01,14.09
N$7  (via drill 0.61)
  Top 0.254: v65.49,29.08 65.49,28.82 58.64,28.82 56.86,27.05 56.86,26.79 53.81,26.79 U$1.24 | v65.75,31.11 65.75,32.89 62.95,35.68 62.95,45.84 63.97,46.86 63.97,48.38 61.43,50.92 61.43,52.45 59.4,54.48 53.05,54.48 53.05,55.24 JP5.10
  Bottom 0.254: v65.49,29.08 65.49,31.11 v65.75,31.11
N$8  (via drill 0.61)
  Top 0.254: v46.19,19.68 45.68,19.68 44.67,20.7 44.67,21.2 46.44,22.98 46.44,23.49 U$1.16 | v43.65,19.68 38.57,19.68 38.57,15.87 36.54,13.84 v32.73,13.84
  Bottom 0.254: v43.65,19.68 v46.19,19.68 | v32.73,13.84 32.47,13.58 20.79,13.58 16.98,17.39 10.12,17.39 9.36,18.16 SW2.8 SV1.3
N$9  (via drill 0.61)
  Top 0.254: v56.35,29.59 56.35,27.55 53.81,27.55 U$1.25 | v48.73,42.03 49.49,42.79 49.49,43.56 50.25,44.32 50.25,49.4 v50.76,49.91
  Bottom 0.254: v56.35,29.59 59.14,32.38 59.14,36.44 54.32,36.44 v48.73,42.03 | v50.76,49.91 52.79,51.94 52.79,54.48 53.81,54.48 54.57,55.24 JP5.11
N$11  (via drill 0.61)
  Top 0.254: v53.56,38.73 52.79,38.73 50.76,36.7 50.76,36.19 U$1.35 | v55.33,40.51 57.37,42.54 57.37,50.92 v57.62,51.18
  Bottom 0.254: v53.56,38.73 v55.33,40.51 | v57.62,51.18 JP5.12
N$12  (via drill 0.61)
  Top 0.254: v46.44,25.52 45.94,25.01 45.94,24.76 U$1.15 | v52.54,22.22 53.81,22.22 54.32,21.71 58.38,21.71 58.38,19.68 59.65,18.41 JP4.3
  Bottom 0.254: v46.44,25.52 50.51,21.46 51.78,21.46 v52.54,22.22
N$13  (via drill 0.61)
  Top 0.254: v55.59,42.03 51.02,42.03 47.46,38.48 U$1.39 | v58.89,41.27 62.45,41.27 62.45,34.92 v64.73,32.63 | v78.96,23.49 79.97,22.47 79.97,15.36 83.02,12.31 83.02,5.46 83.53,4.95 87.59,4.95 87.59,5.46 LED1.A
  Bottom 0.254: v55.59,42.03 56.35,41.27 v58.89,41.27 | v64.73,32.63 64.99,32.38 70.07,32.38 75.65,26.79 75.65,25.78 77.43,25.78 78.7,24.51 78.7,23.49 v78.96,23.49
N$14  (via drill 0.61)
  Top 0.254: v35.52,31.87 36.54,30.86 36.54,30.09 39.84,30.09 39.84,30.6 41.11,30.6 U$1.5 | v34.25,33.14 33.74,32.63 v33.74,25.27
  Bottom 0.254: v34.25,33.14 v35.52,31.87 | v33.74,25.27 34,25.01 38.32,25.01 41.87,21.46 41.87,19.17 42.89,19.17 43.4,18.66 43.9,18.66 44.41,19.17 45.43,19.17 46.19,18.41 46.95,18.41 JP4.8
N$15  (via drill 0.61)
  Top 0.254: v41.62,24.25 40.35,25.52 40.35,26.54 41.11,26.54 U$1.10
  Bottom 0.254: v41.62,24.25 43.4,22.47 46.7,22.47 50,19.17 61.43,19.17 62.19,18.41 JP4.2
N$16  (via drill 0.61)
  Top 0.254: v43.65,25.52 43.65,27.3 42.38,27.3 U$1.9 | v48.22,22.22 49.24,22.22 52.29,19.17 54.57,19.17 54.57,18.41 JP4.5
  Bottom 0.254: v43.65,25.52 46.19,22.98 47.46,22.98 v48.22,22.22
N$17  (via drill 0.61)
  Top 0.254: v54.57,37.46 52.29,35.17 52.29,34.41 51.52,34.41 49.75,32.63 49.75,24.76 U$1.20 | v55.84,38.73 57.87,38.73 57.87,41.52 61.68,45.33 | 61.68,45.33 62.95,46.6 v62.95,47.11 | v66.51,51.68 65.49,50.67 65.49,45.59 v64.99,45.08 | 61.68,45.33 v61.94,45.08
  Bottom 0.254: v54.57,37.46 v55.84,38.73 | v62.95,47.11 64.48,47.11 R10.1 | v66.51,51.68 65.75,50.92 R11.2 | v61.94,45.08 v64.99,45.08
N$18  (via drill 0.61)
  Top 0.254: v85.31,56.26 85.31,55.49 88.86,55.49 89.12,55.75 91.15,55.75 R12.1
  Bottom 0.254: v85.31,56.26 83.02,56.26 82.26,55.49 IR.A
N$19  (via drill 0.61)
  Top 0.254: v94.96,4.69 94.96,5.2 95.21,5.46 LED3.A | v85.05,11.04 80.48,15.62 v80.48,23.24 | v68.29,31.36 64.99,34.67 64.99,39.24 v63.97,40.25 | v56.35,43.05 50,43.05 50,41.78 46.95,38.73 46.95,37.71 45.94,36.7 45.94,36.19 U$1.41
  Bottom 0.254: v94.96,4.69 88.61,11.04 v85.05,11.04 | v80.48,23.24 79.72,22.47 78.19,22.47 76.92,23.74 75.91,23.74 71.34,28.32 71.34,30.35 70.32,31.36 v68.29,31.36 | v63.97,40.25 61.18,43.05 v56.35,43.05
N$21
  Bottom 0.254: SW2.3 16.98,18.16 21.04,14.09 31.71,14.09 32.73,15.11 56.35,15.11 57.11,15.87 JP4.4
N$22
  Top 0.254: LED4.A 2.5,3.42 1.74,4.19 1.74,8.25 2.25,8.76 R1.1
N$23
  Bottom 0.254: U$4.P$11 85.56,36.19 84.04,36.19 83.02,35.17 JP6.4
N$24  (via drill 0.61)
  Top 0.254: v51.78,33.4 51.78,33.14 52.54,33.14 U$1.32 | v46.7,39.75 47.71,40.76 47.71,47.11 48.22,47.62 v48.22,49.91
  Bottom 0.254: v51.78,33.4 47.71,37.46 47.71,39.75 v46.7,39.75 | v48.22,49.91 49.75,51.43 49.75,55.24 JP5.9
N$25  (via drill 0.61)
  Top 0.254: v59.91,36.95 55.59,32.63 55.59,32.38 53.81,32.38 U$1.31 | v56.86,40 57.37,40.51 57.37,41.78 57.87,42.29 57.87,49.4 60.41,51.94 v60.41,52.19
  Bottom 0.254: v59.91,36.95 v56.86,40 | v60.41,52.19 60.41,55.24 JP5.13
N$26  (via drill 0.61)
  Top 0.254: v51.78,32.13 51.78,31.62 52.54,31.62 U$1.30 | v54.57,34.67 57.11,37.21 58.89,37.21 v60.92,39.24 | v65.24,40.25 68.29,40.25 68.29,41.27 68.54,41.52 U$5.P$3
  Bottom 0.254: v51.78,32.13 54.32,34.67 v54.57,34.67 | v60.92,39.24 64.22,39.24 v65.24,40.25
N$29  (via drill 0.61)
  Top 0.254: v55.59,20.19 52.03,20.19 49.24,22.98 49.24,23.49 U$1.19 | v93.94,30.09 93.43,30.6 93.43,37.71 92.93,38.22 v92.93,39.24 | v85.05,44.83 84.04,45.84 84.04,48.13 82.77,49.4 82.77,51.43 81.5,52.7 68.8,52.7 68.8,54.48 65.75,57.53 JP5.15
  Bottom 0.254: v55.59,20.19 57.11,21.71 75.4,21.71 75.91,21.2 84.04,21.2 87.85,25.01 88.86,25.01 v93.94,30.09 | v92.93,39.24 89.12,43.05 89.12,44.83 v85.05,44.83
N$30
  Bottom 0.254: U$4.P$12 87.08,40.25 83.27,40.25 80.99,37.97 80.99,35.43 80.23,35.43 JP6.6
N$31
  Bottom 0.254: U$4.P$10 87.08,35.17 85.56,35.17 JP6.2
N$32  (via drill 0.61)
  Top 0.254: v45.68,30.86 45.68,31.36 42.38,31.36 U$1.4 | v58.38,25.27 58.38,24.25 59.91,22.73 v59.91,20.7 | v56.86,20.19 56.35,19.68 56.35,15.87 55.59,15.11 45.43,15.11 45.43,15.87 JP4.9
  Bottom 0.254: v45.68,30.86 51.27,25.27 v58.38,25.27 | v59.91,20.7 59.4,20.19 v56.86,20.19
N$33  (via drill 0.61)
  Top 0.254: v43.14,30.09 43.14,29.84 U$1.6 | v11.39,25.01 6.82,25.01 6.82,24.51 6.31,24 6.31,14.6 7.07,13.84 SW2.10
  Bottom 0.254: v43.14,30.09 39.84,26.79 39.84,25.78 34.51,25.78 29.93,30.35 29.93,32.38 29.68,32.38 29.43,32.63 19.01,32.63 v11.39,25.01 | SV1.5 SW2.10
N$34  (via drill 0.61)
  Top 0.254: v45.68,20.95 47.46,22.73 U$1.17 | v42.89,20.7 37.81,20.7 v37.81,20.95
  Bottom 0.254: v45.68,20.95 45.43,20.7 v42.89,20.7 | v37.81,20.95 36.79,21.97 33.49,21.97 29.43,26.03 29.43,31.87 29.17,32.13 19.77,32.13 9.11,21.46 SW2.7 SV1.2
N$35
  Top 0.254: U$1.14 44.92,23.49 44.92,22.22 44.16,21.46 44.16,20.44 45.94,18.66 46.44,18.66 46.95,19.17 49.49,19.17 49.49,18.41 JP4.7
N$36  (via drill 0.61)
  Top 0.254: v42.63,21.97 42.63,25.52 42.38,25.78 U$1.11 | v46.95,20.95 48.48,20.95 48.48,20.7 49.49,19.68 51.02,19.68 51.02,19.43 52.03,18.41 JP4.6
  Bottom 0.254: v42.63,21.97 45.94,21.97 v46.95,20.95
N$37  (via drill 0.61)
  Top 0.254: v40.09,32.63 40.09,32.38 41.11,32.38 U$1.3 | v38.82,22.98 v38.82,26.79
  Bottom 0.254: v40.09,32.63 40.09,27.81 39.08,26.79 v38.82,26.79 | v38.82,22.98 40.09,21.71 40.09,19.17 41.11,19.17 41.87,18.41 JP4.10
N$38  (via drill 0.61)
  Top 0.254: v43.14,32.89 42.38,32.89 U$1.2 | v35.01,39.49 28.92,39.49 28.92,25.27 v30.44,23.74
  Bottom 0.254: v43.14,32.89 43.14,34.16 38.57,38.73 35.78,38.73 v35.01,39.49 | v30.44,23.74 33.74,20.44 37.05,20.44 39.08,18.41 39.33,18.41 JP4.11
N$39  (via drill 0.61)
  Top 0.254: v48.73,29.84 44.16,29.84 43.4,29.08 42.38,29.08 U$1.7 41.11,29.08 39.33,29.08 C4.1 37.81,29.08 35.52,29.08 v35.52,30.35 | v50.76,29.84 U$1.28 | v17.23,14.6 17.74,15.11 17.74,16.38 20.03,16.38 R3.2 21.3,17.9 21.3,18.66 v25.11,18.66 | SV1.4 1.99,15.36 1.23,14.6 1.23,2.41 2.25,1.39 8.34,1.39 8.34,11.3 9.87,12.82 9.87,14.6 9.11,15.36 SW2.9 | v27.9,34.41 19.27,25.78 v19.27,20.7
  Bottom 0.254: v48.73,29.84 v50.76,29.84 | v17.23,14.6 16.98,14.85 10.12,14.85 9.36,15.62 SW2.9 | v35.52,30.35 31.46,34.41 v27.9,34.41 | v19.27,20.7 21.3,18.66 v25.11,18.66
N$40  (via drill 0.61)
  Top 0.254: v37.81,34.41 39.84,36.44 39.84,36.95 43.9,36.95 44.16,36.7 44.16,36.19 U$1.43 | v35.78,33.4 34.51,32.13 34.51,28.32 35.78,27.05 v35.78,19.43
  Bottom 0.254: v37.81,34.41 36.79,33.4 v35.78,33.4 | v35.78,19.43 36.79,18.41 JP4.12
N$41  (via drill 0.61)
  Top 0.254: v75.4,28.57 75.4,38.73 U$10.P$3
  Bottom 0.254: v75.4,28.57 75.65,28.32 78.45,28.32 79.21,27.55 JP7.2
N$42  (via drill 0.61)
  Top 0.254: R5.2 93.94,12.82 92.93,13.84 92.93,20.95 92.67,21.2 IC3.2 92.42,23.24 92.42,25.01 91.91,25.52 91.91,30.09 v91.4,30.6 | v83.53,39.24 83.53,47.37 82,48.89 D1.K
  Bottom 0.254: v83.53,39.24 84.04,39.75 88.86,39.75 89.88,38.73 89.88,30.6 v91.4,30.6
N$43
  Top 0.254: R4.1 93.94,17.9 93.94,21.2 IC3.3 93.69,23.24 93.18,23.74 93.18,28.82 92.93,29.08 92.93,31.11 92.42,31.62 R2.2
N$44  (via drill 0.61)
  Top 0.254: R5.1 91.15,12.82 90.64,13.33 90.64,15.87 90.39,16.12 90.39,20.44 91.15,21.2 IC3.1 91.15,23.24 89.88,24.51 89.88,36.95 v90.89,37.97 | v93.94,38.48 93.94,40.25 IC1.3
  Bottom 0.254: v93.94,38.48 93.43,37.97 v90.89,37.97
N$45  (via drill 0.61)
  Top 0.254: v80.99,11.81 76.42,11.81 U$6.P$1
  Bottom 0.254: v80.99,11.81 84.29,11.81 85.81,13.33 U$4.P$1
N$46  (via drill 0.61)
  Top 0.254: v78.19,29.59 78.19,35.94 U$10.P$4
  Bottom 0.254: v78.19,29.59 79.21,28.57 80.73,28.57 81.75,27.55 JP7.4
N$47  (via drill 0.61)
  Top 0.254: v92.42,44.57 92.42,42.29 IC1.2 | v90.13,43.3 89.37,42.54 v89.37,17.14
  Bottom 0.254: v92.42,44.57 91.15,43.3 v90.13,43.3 | v89.37,17.14 89.12,16.89 83.02,16.89 82.26,16.12 R7.P$3
N$48  (via drill 0.61)
  Top 0.254: v62.7,33.4 61.94,34.16 61.94,40.25 60.67,40.25 58.64,38.22 58.64,37.71 55.59,37.71 54.83,38.48 54.83,39.75 49.75,39.75 48.48,38.48 48.48,36.19 U$1.38 | v86.58,25.01 86.07,24.51 86.07,8 84.8,6.73 LED0.A
  Bottom 0.254: v62.7,33.4 65.24,35.94 77.43,35.94 78.7,34.67 78.7,33.65 83.02,33.65 83.78,32.89 83.78,26.03 85.56,26.03 v86.58,25.01
N$49  (via drill 0.61)
  Top 0.254: v80.99,31.11 81.24,30.86 81.24,29.08 81.75,28.57 84.54,28.57 84.54,27.81 JP7.6
  Bottom 0.254: v80.99,31.11 78.7,31.11 78.7,32.89 U$10.P$5
N$50
  Top 0.254: U$7.2 16.73,34.67 15.71,35.68 15.71,41.52 10.12,47.11 10.12,49.4 U$3.9
N$51
  Top 0.254: 5.04,52.7 4.53,52.7 4.53,50.16 D2.A D3.C | 5.04,52.7 14.95,52.7 15.71,51.94 15.71,51.18 16.22,51.18 U$3.4 | 5.04,52.7 5.04,55.24 4.28,56 JP1.1
N$52  (via drill 0.61)
  Top 0.254: 18.25,51.94 18.25,48.64 15.71,48.64 15.71,49.4 15.2,49.4 U$3.5 | 18.25,51.94 24.35,51.94 24.35,50.16 D4.C D5.A | v5.8,55.75 18.25,55.75 18.25,51.94
  Bottom 0.254: v5.8,55.75 5.55,55.75 4.28,54.48 JP1.2
N$57  (via drill 0.61)
  Top 0.254: v70.32,30.09 71.59,31.36 71.59,42.54 U$10.P$2 | v67.53,27.05 66.76,26.28 v66.76,16.12 | v50,14.09 v64.73,14.09 | v47.97,13.33 45.94,13.33 45.94,13.08 U$9.P$1
  Bottom 0.254: v70.32,30.09 67.53,27.3 v67.53,27.05 | v64.73,14.09 v66.76,16.12 | v50,14.09 49.49,13.58 48.22,13.58 v47.97,13.33
SERIALIN  (via drill 0.61)
  Top 0.254: v44.16,33.9 42.38,33.9 U$1.1 | v37.05,40.25 37.3,40.51 37.3,46.35 38.82,47.87 v38.82,49.14 | v64.48,51.94 65.49,51.94 v67.78,54.22 | v69.05,55.49 75.91,55.49 75.91,57.02 76.67,57.78 83.78,57.78 v83.78,57.53
  Bottom 0.254: v44.16,33.9 38.82,39.24 38.06,39.24 v37.05,40.25 | v38.82,49.14 39.84,50.16 46.7,50.16 47.97,48.89 61.43,48.89 v64.48,51.94 | v67.78,54.22 v69.05,55.49 | v83.78,57.53 84.04,57.27 87.34,57.27 U$4.P$18
SERIALOUT  (via drill 0.61)
  Top 0.254: v40.09,34.41 40.09,34.92 43.4,34.92 U$1.44 | v51.02,22.47 52.29,21.2 57.87,21.2 57.87,19.43 58.89,18.41 58.89,15.87 59.65,15.11 76.16,15.11 76.16,21.71 U$10.P$10
  Bottom 0.254: v40.09,34.41 47.71,26.79 47.71,25.01 48.48,25.01 v51.02,22.47
VCC
  Top 0.254: R7.P$2 84.54,13.84 84.54,24.25 JP7.5 | JP7.5 JP7.3 JP7.1 | R4.2 91.91,17.9 91.91,24.76 91.4,25.27 91.4,26.28 IC3.8 91.15,28.32 90.39,29.08 90.39,34.67 91.15,35.43 R6.2 91.91,36.95 91.91,43.81 91.4,44.32 91.4,45.33 IC1.8 91.4,47.37 91.4,50.67 C2.1 91.91,52.19 91.91,53.72 93.94,55.75 R12.2 93.94,57.27 93.94,57.78 85.31,57.78 83.27,55.75 83.27,52.19 84.04,51.43 D1.A 84.54,48.89 86.07,47.37 86.07,26.03 85.31,25.27 JP7.5
  Bottom 0.254: U$10.P$8 78.96,25.01 79.21,25.01 JP7.1

### Text on the board
tPlace: Rx | 5V | GND | 5V | Tx